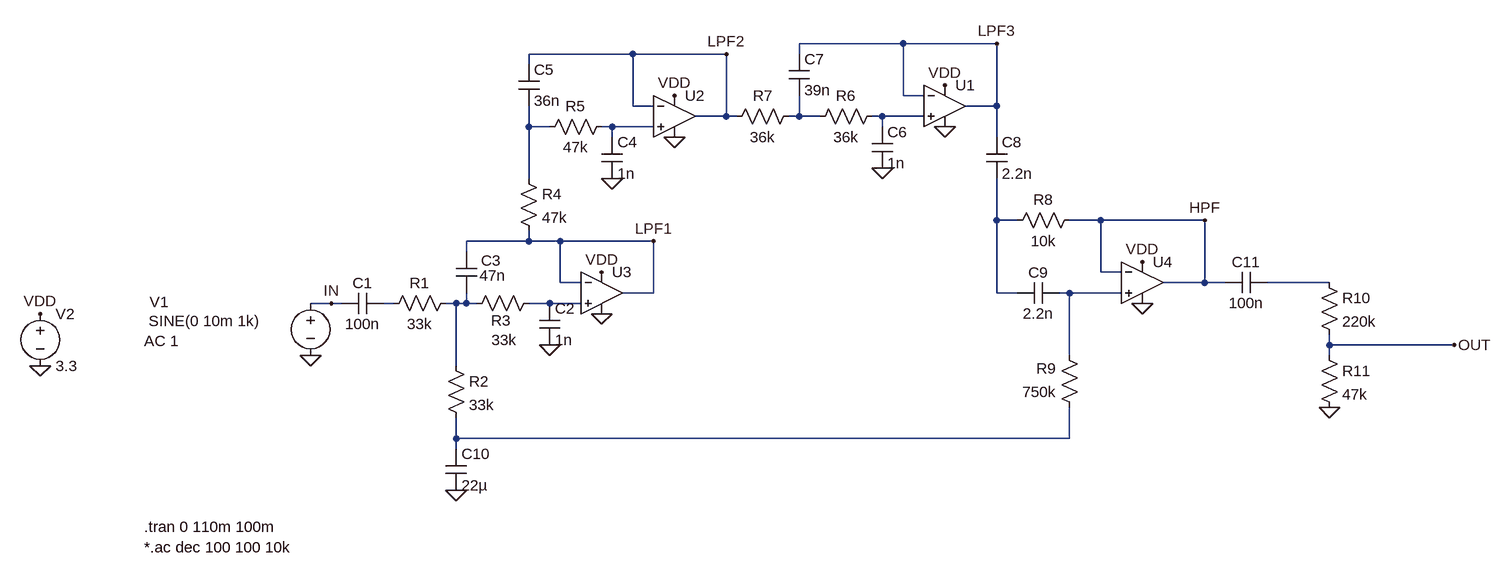
[diagram p0: schematic NM0S Hipermite.asc]
NM0S Hipermite.asc, the LTspice schematic file:
Version 4
SHEET 1 3216 724
WIRE 864 -544 704 -544
WIRE 1008 -544 864 -544
WIRE 448 -528 288 -528
WIRE 592 -528 448 -528
WIRE 704 -528 704 -544
WIRE 288 -512 288 -528
WIRE 864 -464 864 -544
WIRE 896 -464 864 -464
WIRE 448 -448 448 -528
WIRE 480 -448 448 -448
WIRE 1008 -448 1008 -544
WIRE 1008 -448 960 -448
WIRE 592 -432 592 -528
WIRE 592 -432 544 -432
WIRE 608 -432 592 -432
WIRE 704 -432 704 -464
WIRE 704 -432 688 -432
WIRE 736 -432 704 -432
WIRE 832 -432 816 -432
WIRE 896 -432 832 -432
WIRE 288 -416 288 -448
WIRE 320 -416 288 -416
WIRE 416 -416 400 -416
WIRE 480 -416 416 -416
WIRE 832 -416 832 -432
WIRE 416 -400 416 -416
WIRE 1008 -400 1008 -448
WIRE 288 -336 288 -416
WIRE 1008 -272 1008 -336
WIRE 1040 -272 1008 -272
WIRE 1168 -272 1120 -272
WIRE 1328 -272 1168 -272
WIRE 288 -240 288 -256
WIRE 288 -240 192 -240
WIRE 336 -240 288 -240
WIRE 480 -240 336 -240
WIRE 192 -224 192 -240
WIRE 1168 -192 1168 -272
WIRE 1200 -192 1168 -192
WIRE 336 -176 336 -240
WIRE 368 -176 336 -176
WIRE 1328 -176 1328 -272
WIRE 1328 -176 1264 -176
WIRE 1360 -176 1328 -176
WIRE 1520 -176 1424 -176
WIRE 480 -160 480 -240
WIRE 480 -160 432 -160
WIRE 1008 -160 1008 -272
WIRE 1040 -160 1008 -160
WIRE 1120 -160 1104 -160
WIRE 1200 -160 1120 -160
WIRE -16 -144 -48 -144
WIRE 0 -144 -16 -144
WIRE 80 -144 64 -144
WIRE 176 -144 160 -144
WIRE 192 -144 192 -160
WIRE 192 -144 176 -144
WIRE 208 -144 192 -144
WIRE 320 -144 288 -144
WIRE 368 -144 320 -144
WIRE 1520 -80 1520 -96
WIRE 1712 -80 1520 -80
WIRE 1120 -64 1120 -160
WIRE 1520 -64 1520 -80
WIRE 176 -48 176 -144
WIRE 176 64 176 32
WIRE 1120 64 1120 16
WIRE 1120 64 176 64
WIRE 176 80 176 64
FLAG -464 -48 0
FLAG -464 -128 VDD
FLAG -48 -64 0
FLAG 320 -80 0
FLAG 416 -336 0
FLAG 832 -352 0
FLAG 1232 -208 VDD
FLAG 1232 -144 0
FLAG 928 -480 VDD
FLAG 928 -416 0
FLAG 512 -464 VDD
FLAG 512 -400 0
FLAG 400 -192 VDD
FLAG 400 -128 0
FLAG 176 144 0
FLAG 480 -240 LPF1
FLAG 592 -528 LPF2
FLAG 1008 -544 LPF3
FLAG 1328 -272 HPF
FLAG 1520 16 0
FLAG 1712 -80 OUT
FLAG -16 -144 IN
SYMBOL voltage -48 -160 R0
WINDOW 123 -256 74 Left 2
WINDOW 39 0 0 Left 0
WINDOW 0 -248 14 Left 2
WINDOW 3 -249 43 Left 2
SYMATTR Value2 AC 1
SYMATTR InstName V1
SYMATTR Value SINE(0 10m 1k)
SYMBOL voltage -464 -144 R0
WINDOW 123 0 0 Left 0
WINDOW 39 0 0 Left 0
SYMATTR InstName V2
SYMATTR Value 3.3
SYMBOL cap 64 -160 R90
WINDOW 0 0 32 VBottom 2
WINDOW 3 32 32 VTop 2
SYMATTR InstName C1
SYMATTR Value 100n
SYMBOL res 176 -160 R90
WINDOW 0 0 56 VBottom 2
WINDOW 3 32 56 VTop 2
SYMATTR InstName R1
SYMATTR Value 33k
SYMBOL res 160 -64 R0
SYMATTR InstName R2
SYMATTR Value 33k
SYMBOL res 304 -160 R90
WINDOW 0 58 59 VBottom 2
WINDOW 3 57 54 VTop 2
SYMATTR InstName R3
SYMATTR Value 33k
SYMBOL cap 304 -144 R0
SYMATTR InstName C2
SYMATTR Value 1n
SYMBOL cap 176 -224 R0
WINDOW 0 38 14 Left 2
WINDOW 3 36 37 Left 2
SYMATTR InstName C3
SYMATTR Value 47n
SYMBOL res 272 -352 R0
SYMATTR InstName R4
SYMATTR Value 47k
SYMBOL res 416 -432 R90
WINDOW 0 0 56 VBottom 2
WINDOW 3 32 56 VTop 2
SYMATTR InstName R5
SYMATTR Value 47k
SYMBOL cap 400 -400 R0
SYMATTR InstName C4
SYMATTR Value 1n
SYMBOL cap 272 -512 R0
SYMATTR InstName C5
SYMATTR Value 36n
SYMBOL res 832 -448 R90
WINDOW 0 0 56 VBottom 2
WINDOW 3 32 56 VTop 2
SYMATTR InstName R6
SYMATTR Value 36k
SYMBOL cap 816 -416 R0
SYMATTR InstName C6
SYMATTR Value 1n
SYMBOL cap 688 -528 R0
SYMATTR InstName C7
SYMATTR Value 39n
SYMBOL res 704 -448 R90
WINDOW 0 0 56 VBottom 2
WINDOW 3 32 56 VTop 2
SYMATTR InstName R7
SYMATTR Value 36k
SYMBOL cap 992 -400 R0
SYMATTR InstName C8
SYMATTR Value 2.2n
SYMBOL OpAmps\\UniversalOpAmp 1232 -176 R0
SYMATTR InstName U4
SYMBOL res 1136 -288 R90
WINDOW 0 0 56 VBottom 2
WINDOW 3 32 56 VTop 2
SYMATTR InstName R8
SYMATTR Value 10k
SYMBOL cap 1104 -176 R90
WINDOW 0 0 32 VBottom 2
WINDOW 3 32 32 VTop 2
SYMATTR InstName C9
SYMATTR Value 2.2n
SYMBOL res 1136 32 R180
WINDOW 0 36 76 Left 2
WINDOW 3 36 40 Left 2
SYMATTR InstName R9
SYMATTR Value 750k
SYMBOL OpAmps\\UniversalOpAmp 928 -448 R0
SYMATTR InstName U1
SYMBOL OpAmps\\UniversalOpAmp 512 -432 R0
SYMATTR InstName U2
SYMBOL OpAmps\\UniversalOpAmp 400 -160 R0
SYMATTR InstName U3
SYMBOL cap 160 80 R0
SYMATTR InstName C10
SYMATTR Value 22µ
SYMBOL cap 1424 -192 R90
WINDOW 0 0 32 VBottom 2
WINDOW 3 32 32 VTop 2
SYMATTR InstName C11
SYMATTR Value 100n
SYMBOL res 1504 -192 R0
SYMATTR InstName R10
SYMATTR Value 220k
SYMBOL res 1504 -80 R0
SYMATTR InstName R11
SYMATTR Value 47k
TEXT -304 200 Left 2 !.tran 0 110m 100m\n*.ac dec 100 100 10k

The netlist it stands for:
* NM0S Hipermite.asc
V1 IN 0 SINE(0 10m 1k) AC 1
V2 VDD 0 3.3
C1 N008 IN 100n
R1 N009 N008 33k
R2 N009 N011 33k
R3 N010 N009 33k
C2 N010 0 1n
C3 LPF1 N009 47n
R4 N003 LPF1 47k
R5 N004 N003 47k
C4 N004 0 1n
C5 LPF2 N003 36n
R6 N002 N001 36k
C6 N002 0 1n
C7 LPF3 N001 39n
R7 N001 LPF2 36k
C8 LPF3 N005 2.2n
XU4 N007 HPF VDD 0 HPF level1 Avol=1Meg GBW=10Meg Vos=0 En=0 Enk=0 In=0 Ink=0 Rin=500Meg  ; pins In+ In- V+ V- OUT
R8 HPF N005 10k
C9 N007 N005 2.2n
R9 N011 N007 750k
XU1 N002 LPF3 VDD 0 LPF3 level1 Avol=1Meg GBW=10Meg Vos=0 En=0 Enk=0 In=0 Ink=0 Rin=500Meg  ; pins In+ In- V+ V- OUT
XU2 N004 LPF2 VDD 0 LPF2 level1 Avol=1Meg GBW=10Meg Vos=0 En=0 Enk=0 In=0 Ink=0 Rin=500Meg  ; pins In+ In- V+ V- OUT
XU3 N010 LPF1 VDD 0 LPF1 level1 Avol=1Meg GBW=10Meg Vos=0 En=0 Enk=0 In=0 Ink=0 Rin=500Meg  ; pins In+ In- V+ V- OUT
C10 N011 0 22µ
C11 N006 HPF 100n
R10 N006 OUT 220k
R11 OUT 0 47k
.tran 0 110m 100m
*.ac dec 100 100 10k
.lib UniversalOpAmp1.lib
.backanno
.end